# Altium project SwimmingPool.PrjPcb
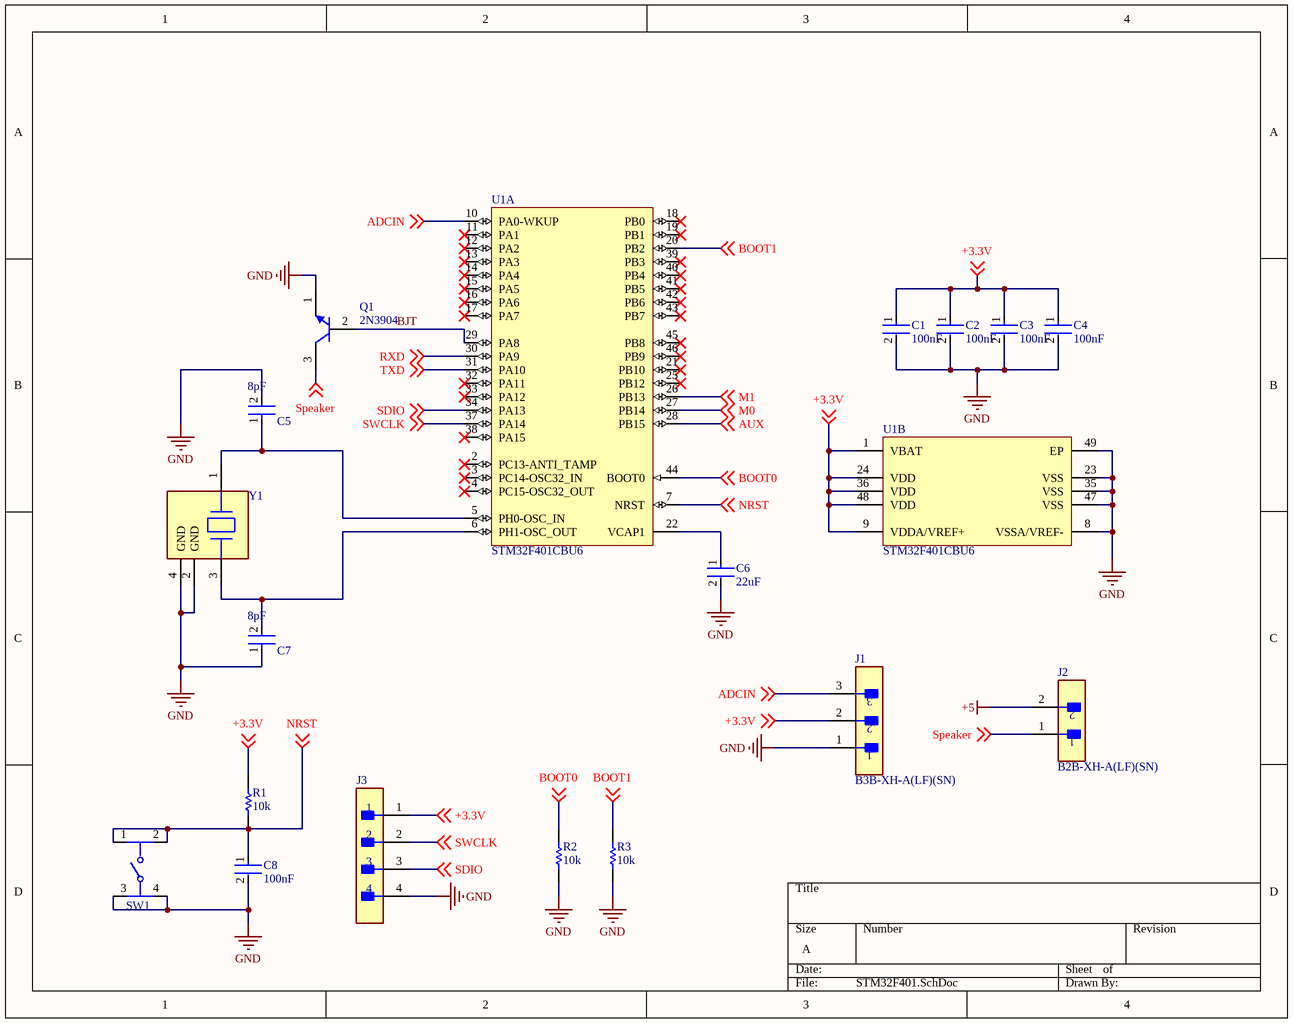
[diagram p0: STM32F401.SchDoc]
3 sheets, 44 parts. Net scope: global (net labels, ports and power ports of the same name join across sheets).
Board file: SwimmingPool.PcbDoc
Sheets:
  STM32F401.SchDoc
  TPS54336ADDA.SchDoc
  E49400T20S.SchDoc

## Sheet STM32F401.SchDoc
size A; SheetNumber: 1; SheetTotal: 3

### Parts
C1  100nF  [FP-CGA3E-0_3-0_1-IPC_A]
C2  100nF  [FP-CGA3E-0_3-0_1-IPC_A]
C3  100nF  [FP-CGA3E-0_3-0_1-IPC_A]
C4  100nF  [FP-CGA3E-0_3-0_1-IPC_A]
C5  8pF  [FP-CGA3E-0_3-0_1-IPC_A]
C6  22uF  [FP-GRM188-0_2-MFG]
C7  8pF  [FP-CGA3E-0_3-0_1-IPC_A]
C8  100nF  [FP-CGA3E-0_3-0_1-IPC_A]
J1  B3B-XH-A(LF)(SN)  [FP-B3B-XH-A_LF_SN-MFG]
J2  B2B-XH-A(LF)(SN)  [FP-B2B-XH-A_LF_SN-MFG]
J3  B04B-XASK-1(LF)(SN)  [FP-B04B-XASK-1_LF_SN-MFG]  (value not drawn)
Q1  2N3904  [ONSC-TO-92-3-29-11]
R1  10k  [RESC1609X55X30LL15T15]
R2  10k  [RESC1609X55X30LL15T15]
R3  10k  [RESC1609X55X30LL15T15]
SW1  PTS645SH50SMTR92LFS  [FP-PTS645SH50SMTR92LFS-MFG]  (value not drawn)
U1  STM32F401CBU6  [STM-UFQFPN48_M]  (parts A,B of 2)
Y1  CX2016DB40000D0FLJCC  [FP-CX2016DB-MFG]  (value not drawn)

### Nets
+5: J2.2  [project net 5V]
GND: C1.2 C2.2 C3.2 C4.2 C5.2 C6.2 C7.1 C8.2 J1.1 J3.4 Q1.1(E) R2.1 R3.1 SW1.3 SW1.4 U1.8(VSSA/VREF-) U1.23(VSS) U1.35(VSS) U1.47(VSS) U1.49(EP) Y1.2(GND) Y1.4(GND)
+3.3V: C1.1 C2.1 C3.1 C4.1 J1.2 J3.1 R1.2 U1.1(VBAT) U1.9(VDDA/VREF+) U1.24(VDD) U1.36(VDD) U1.48(VDD) ; off-sheet +3.3V  [project net 3V]
ADCIN: J1.3 U1.10(PA0-WKUP) ; off-sheet ADCIN
AUX: U1.28(PB15) ; off-sheet AUX
BJT: Q1.2(B) U1.29(PA8)
BOOT0: R2.2 U1.44(BOOT0) ; off-sheet BOOT0
BOOT1: R3.2 U1.20(PB2) ; off-sheet BOOT1
M0: U1.27(PB14) ; off-sheet M0
M1: U1.26(PB13) ; off-sheet M1
NRST: C8.1 R1.1 SW1.1 SW1.2 U1.7(NRST) ; off-sheet NRST
RXD: U1.30(PA9) ; off-sheet RXD
SDIO: J3.3 U1.34(PA13) ; off-sheet SDIO
Speaker: J2.1 Q1.3(C) ; off-sheet Speaker
SWCLK: J3.2 U1.37(PA14) ; off-sheet SWCLK
TXD: U1.31(PA10) ; off-sheet TXD
NetC5_1: C5.1 U1.5(PH0-OSC_IN) Y1.1
NetC6_1: C6.1 U1.22(VCAP1)
NetC7_2: C7.2 U1.6(PH1-OSC_OUT) Y1.3

Not connected (* = marked no-connect by the designer): U1 2(PC13-ANTI_TAMP)* 3(PC14-OSC32_IN)* 4(PC15-OSC32_OUT)* 11(PA1)* 12(PA2)* 13(PA3)* 14(PA4)* 15(PA5)* 16(PA6)* 17(PA7)* 18(PB0)* 19(PB1)* 21(PB10)* 25(PB12)* 32(PA11)* 33(PA12)* 38(PA15)* 39(PB3)* 40(PB4)* 41(PB5)* 42(PB6)* 43(PB7)* 45(PB8)* 46(PB9)*

### Library data of the parts
C1-C4 C8 = CMP-2000-07546-2: Cap Ceramic 100nF 50V X7R 10% Pad SMD 0603 +125°C Automotive T/R; Weight: 7.1E-05oz; Composition: Ceramic; Max Operating Temperature: 125°C; Termination: SMD/SMT; Dielectric: X7R; Length: 1.6mm; Package Quantity: 1; REACH SVHC: No SVHC; Lead Free: Lead Free; Case Code (Metric): 1608; Min Operating Temperature: -55°C; Packaging: Tape and Reel; Tolerance: 10%; Voltage Rating: 50V; Case Code (Imperial): 0603; Capacitance: 100nF; Case/Package: 0603; Voltage Rating (DC): 50V; Depth: 0.8mm; Radiation Hardening: No; Ratings: AEC-Q200; Mount: Surface Mount; Voltage: 50V; Thickness: 0.035inch; Width: 0.8mm; Height: 0.8mm
C5 C7 = CMP-08246-000516-1: Cap Ceramic 8pF 50V C0G 0.5pF Pad SMD 0603 +125°C Automotive T/R; Length: 1.6mm; Max Operating Temperature: 125°C; Voltage Rating: 50V; Depth: 0.8mm; Height: 0.8mm; Composition: Ceramic; Package Quantity: 4000; Thickness: 0.035inch; Packaging: Tape and Reel; Weight: 7.1E-05oz; Mount: Surface Mount; Ratings: AEC-Q200; Width: 0.031inch; Voltage Rating (DC): 50V; Termination: SMD/SMT; Case Code (Metric): 1608; Case Code (Imperial): 0603; Capacitance: 8pF; Min Operating Temperature: -55°C; Dielectric: C0G; Case/Package: 0603; Radiation Hardening: No; REACH SVHC: No SVHC
C6 = CMP-2000-06337-3: Chip Multilayer Ceramic Capacitors for General Purpose, 0603, 22uF, X5R, 15%, 20%, 10V; Tolerance: 20%; Weight: 0.000222oz; Material: Ceramic; Depth: 0.8mm; Length: 1.6mm; Termination: SMD/SMT; Capacitance: 22uF; Packaging: Tape and Reel; Width: 0.8mm; Voltage Rating: 10V; Case Code (Imperial): 0603; Mount: Surface Mount; Voltage Rating (DC): 10V; Case/Package: 0603; Thickness: 0.039inch; REACH SVHC: No SVHC; Dielectric: X5R; Height: 0.8mm; Package Quantity: 4000; Case Code (Metric): 1608; Min Operating Temperature: -55°C; Lead Free: Lead Free; Max Operating Temperature: 85°C
J1 = CMP-17439-000014-3: CONN HEADER VERT 3POS 2.5MM; Max Voltage Rating (DC): 250V; Number of Positions: 3; Current Rating: 3A; Gender: Male; Wire/Cable Gauge: 22AWG; Contact Resistance: 20mR; Insulation Resistance: 1GR; Insulation Material: Nylon; Contact Plating: Tin; Depth: 5.75mm; Contact Type: Male Pin; Max Operating Temperature: 85°C; Insulation Color: Natural; Voltage Rating (AC): 250V; Color: Natural; Connector Type: Header; Orientation: Straight; Fastening Type: Detent; Housing Color: White; Min Operating Temperature: -25°C; Termination: Solder; Voltage Rating: 250V; Series: XH; Pitch: 2.5mm; Contact Shape: Square; Number of Rows: 1; Lead Free: Lead Free; Packaging: Bulk; Mount: Through Hole; Flammability Rating: UL94 V-0; Max Voltage Rating (AC): 250V; REACH SVHC: No SVHC; Housing Material: Polyamide; Contact Material: Brass; Lead Pitch: 2.5mm; Contact Finish - Mating: TIN; Length: 9.9mm; Max Current Rating: 3A; Number of Contacts: 3
J2 = CMP-2000-05888-3: CONN HEADER VERT 2POS 2.5MM; Current Rating: 3A; Voltage Rating: 250V; Number of Contacts: 2; Contact Resistance: 20mR; Wire/Cable Gauge: 22AWG; Insulation Resistance: 1GR; Connector Type: Male Pin; Packaging: Bulk; Contact Material: Brass; Lead Free: Lead Free; Orientation: Straight; Contact Plating: Tin; Max Current Rating: 3A; Termination: Solder; Fastening Type: Detent; Depth: 5.75mm; Housing Material: Polyamide; REACH SVHC: No SVHC; Series: XH; Voltage Rating (AC): 250V; Number of Positions: 2; Color: Natural; Contact Type: Male Pin; Max Voltage Rating (DC): 250V; Pitch: 2.5mm; Lead Pitch: 2.5mm; Mount: Through Hole; Max Operating Temperature: 85°C; Length: 7.4mm; Max Voltage Rating (AC): 250V; Min Operating Temperature: -25°C; Number of Rows: 1; Housing Color: White
J3 = CMP-17439-000018-1: CONN HEADER VERT 4POS 2.5MM; Manufacturer: JST; Current Rating: 3A; Voltage Rating: 250V; Conn Orientation: Straight; Conn Gender: Male; Number Of Contacts: 4; ComponentLink2Description: Datasheet; Package: B04B-XASK-1(LF)(SN); Octopart: https://octopart.com/b04b-xask-1%28lf%29%28sn%29-jst-3990149; Pitch: 2.5mm; Device Class L1: Connectors; RoHS: TRUE; Device Class L3: unset; Manufacturer Part Number: B04B-XASK-1(LF)(SN); Temperature Range High: +85°C; Height: 8.8mm; Lead Free: Yes; Category: Conn; Temperature: -25°C to +85°C; Digikey Description: CONN HEADER VERT 4POS 2.5MM; Temperature Range Low: -25°C; ComponentLink2URL: http://www.jst-mfg.com/product/pdf/eng/eXA1.pdf; Contact Material: Tin,Copper; Device Class L2: Headers and Wire Housings; Automotive: No; Number Of Rows: 1
Q1 = CMP-2000-05562-1: General Purpose Transistor, NPN Silicon, 200 mA, 60 V, -55 to 150 degC, 3-Pin TO-92, RoHS, Bulk; Manufacturer: ONSemiconductor; Emitter- Base Voltage VEBO: 6V; Maximum Power Dissipation: 625mW; Maximum DC Collector Current: 0.2A; Collector- Emitter Voltage VCEO Max: 40V; Collector- Base Voltage VCBO: 60V; DC Collector/Base Gain hfe Min: 60; Configuration: Single; Collector-Emitter Saturation Voltage: 0.3V; Gain Bandwidth Product fT: 270MHz; Mounting Style: ThroughHole; Package / Case: TO-92-3(TO-226); Mounting Technology: ThroughHole; Minimum Operating Temperature: -65C; Datasheet Version: Rev. 8, 08/2012; Product Category: BipolarTransistors-BJT; Factory Pack Quantity: 5000; Transistor Polarity: NPN; Package Description: 3-Pin Transistor Outline, Body 4.825 x 3.685 mm, Pitch 1.27 mm; RoHS: Details; Datasheet URL: https://datasheet.ciiva.com/4725/2n3903-d-285841-4725808.pdf; Packaging: Bulk; Maximum Operating Temperature: +150C; Package Reference: TO-92-3-29-11; Brand: ONSemiconductor; Manufacturer URL: http://www.onsemi.com/
R1-R3 = CMP-1012-00623-3: Chip Resistor, 10 KOhm, +/- 1%, 0.1 W, -55 to 155 degC, 0603 (1608 Metric), RoHS, Tape and Reel; Manufacturer: Panasonic; Voltage Rating: 75V; Case\/Package: 0603; Power Rating: 100mW; Resistance: 10KOhm; Temperature Coefficient: 100ppm\/degreesC; Number of Pins: 2; Package Reference: 603; Depth: 0.8mm; Mount: SurfaceMount; Package Description: 2-Pin Surface Mount Device, Body 1.6 x 0.85 mm; Datasheet Version: 02/2017; Length: 1.6mm; Lead Free: LeadFree; Height: 0.45mm; Number of Terminations: 2; Max Power Dissipation: 100mW; Min Operating Temperature: -55degC; Datasheet URL: https://industrial.panasonic.com/cdbs/www-data/pdf/RDA0000/AOA0000C304.pdf; Termination: SMD/SMT; Case Code (Metric): 1608; Case Code (Imperial): 0603; Tolerance: 1%; Max Operating Temperature: 155degC; RoHSCompliant: true; Voltage Rating (DC): 75V; Radiation Hardening: No; Packaging: TapeandReel; Composition: ThickFilm; Mounting Technology: SurfaceMount; Manufacturer URL: http://www.panasonic.com/; Width: 0.031inch; REACH SVHC: NoSVHC; Contact Plating: Tin; Military Standard: Not; Package Quantity: 1
SW1 = CMP-10040-000028-1: SWITCH TACTILE SPST-NO 0.05A 12V; Operating Force: 200gf; Current Rating: 50mA; Illumination Type: Non-Illuminated; Actuator Material: Nylon; Throw Configuration: SPST; Switch Function: Off-Mom; Mechanical Life: 100000Cycles; Actuator Type: Standard; Packaging: Tape and Reel; Termination: Gull Wing; Max Operating Temperature: 60°C; Length: 6mm; REACH SVHC: No SVHC; Orientation: Straight; Max Voltage Rating (DC): 12V; Package Quantity: 1000; Max Current Rating: 50mA; Mount: Surface Mount; Contact Material: Bronze; Case/Package: SMD/SMT; Lead Free: Lead Free; Min Operating Temperature: -20°C; Contact Plating: Silver; Color: Black; Depth: 9mm; Voltage Rating (DC): 12V
U1 = CMP-0243-00118-2: ARM Cortex-M4 32-bit MCU+FPU, 105 DMIPS, 128 kB Flash, 64 kB Internal RAM, 36 I/Os, 48-pin UFQFPN, -40 to 85 degC, Tray; Manufacturer: STMicroelectronics; Internal RAM Size (kB): 64; I/Os (High Current): 36; Operating Frequency(F) (Processor speed) (MHz): 84; Supply Voltage(Vcc) min (V): 1.8; FLASH Size (Prog) (kB): 128; Supply Voltage(Vcc) max (V): 3.6; PackageDescription: 48-Pin Ultra Thin Fine Pitch Quad Flat No-Lead, 7 x 7 x 0.6 mm Body, 0.5 mm Pitch, Exposed Pad; Mounting Technology: Surface Mount; PartNumber: STM32F401CBU6; ComponentLink1Description: Manufacturer URL; ComponentLink1URL: http://www.st.com/web/en/home.html; Core: ARM Cortex-M4; ComponentLink2URL: http://www.st.com/st-web-ui/static/active/en/resource/technical/document/data_brief/DM00071938.pdf; ComponentLink3Description: Package Specification; DatasheetVersion: Rev. 1; PackageReference: UFQFPN48; Packing: Tray; PackageVersion: Rev. 1, 04/2013; ComponentLink3URL: http://www.st.com/st-web-ui/static/active/en/resource/technical/document/data_brief/DM00071938.pdf; ComponentLink2Description: Datasheet
Y1 = CMP-20727-000002-1: CRYSTAL 40.0000MHZ 8PF SMD; Manufacturer: Kyocera International Inc. Electronic Components; Esr: 50Ω; Tolerance: 15ppm; Frequency: 40MHz; Series: CX2016DB; RoHS: TRUE; Temperature Range High: +85°C; Height: 0.45mm; Manufacturer Part Number: CX2016DB40000D0FLJCC; ComponentLink2Description: Datasheet; Load Capacitance: 8pF; ComponentLink2URL: https://global.kyocera.com/prdct/electro/product/pdf/cx2016db_e.pdf; Temperature: -30°C to +85°C; Device Class L2: Crystals / Oscillators; Category: Crys; Mouser Description: Crystal 40MHz 8pF 4-Pin SMD T/R; Lead Free: Yes; Device Class L3: Crystals; Temperature Range Low: -30°C; Octopart: https://octopart.com/cx2016db40000d0fljcc-avx+%2F+kyocera-71139660; Device Class L1: Passive Components; Automotive: No; Digikey Description: CRYSTAL 40.0000MHZ 8PF SMD; Package: CX2016DB; Stability: 15ppm

## Sheet TPS54336ADDA.SchDoc
size A; SheetNumber: 2; SheetTotal: 3; SPICEModelCacheGCWZWCBQ: <root> / <DocumentId>GCWZWCBQ</DocumentId> / <CacheFrame Number="0"> / <Model Name="umk107bj105_a-t" Kind="CKT"> / <Text>* UMK107BJ105_A-T     SPICE MODEL  ( General Type ) / *-------------------------------------------------------------------------------------------------------- / * Model Generated by TAIYO YUDEN Corporation (http://www.ty-top.com) / * Version 1.0 / * TAIYO YUDEN Control No. 170508_130520 / * Copyright(c) 2012 TAIYO YUDEN CO.,LTD. All Rights Reserved. / *-------------------------------------------------------------------------------------------------------- / * / * Products Name : Multilayer Ceramic Capacitors / * / * Characteristics : / *     Capacitance : 1 uF , Rated Voltage : 50V , TCC : X5R / *     Case Size : 1.6 x 0.8 / 0.063 x 0.031 [mm/inch] , Thickness : 0.8 / 0.031 [mm/inch] / *     (Conditions: Temperature = 25 degC , DC Bias Current/Voltage = 0A / 0V) / * / * Frequency Range : 40Hz - 3GHz / * / * External Node Assignments : / * / *  1  o---| |---o  2 / * / *-------------------------------------------------------------------------------------------------------- / .SubCkt UMK107BJ105_A-T 1 2 / **************************** / C0 1 110 0.79929u / Cm 1 101 0.13681u / C1 101 102 0.26224u / Rc1 101 102 5.8806k / C2 102 103 0.057839u / Rc2 102 103 469.42 / C3 103 110 0.014568u / Rc3 103 110 14.853 / C2m 1 301 0.13283u / C21 301 302 1.2593u / Rc21 301 302 6.3079k / C22 302 303 1.1189u / Rc22 302 303 6.9405k / C23 303 304 1.1421u / Rc23 303 304 6.4848k / C24 304 305 0.36861u / Rc24 304 305 785 / C25 305 306 0.39327u / Rc25 305 306 637.41 / C26 306 307 0.27451u / Rc26 306 307 19.365 / C27 307 308 0.15295u / Rc27 307 308 23.239 / C28 308 309 0.17569u / Rc28 308 309 17.788 / C29 309 110 1420.6p / Rc29 309 110 1.9725 / Rp0 1 110 500Meg / L0 110 120 0.24088n / Lm 120 130 0.1369n / L1 120 121 0.1842n / RL1 121 130 0.29804 / L2 120 122 0.40657n / RL2 122 130 0.57395 / L3 120 123 0.85773n / RL3 123 130 0.82282 / CR 120 124 0.11463u / LR 124 125 0.25983n / RR 125 130 52.447m / CL 130 140 1.4637p / LL 130 140 0.23986n / RL 130 140 33.985 / Rs 140 2 6.8539m / **************************** / .ends UMK107BJ105_A-T</Text> / </Model> / </CacheFrame> / </root>
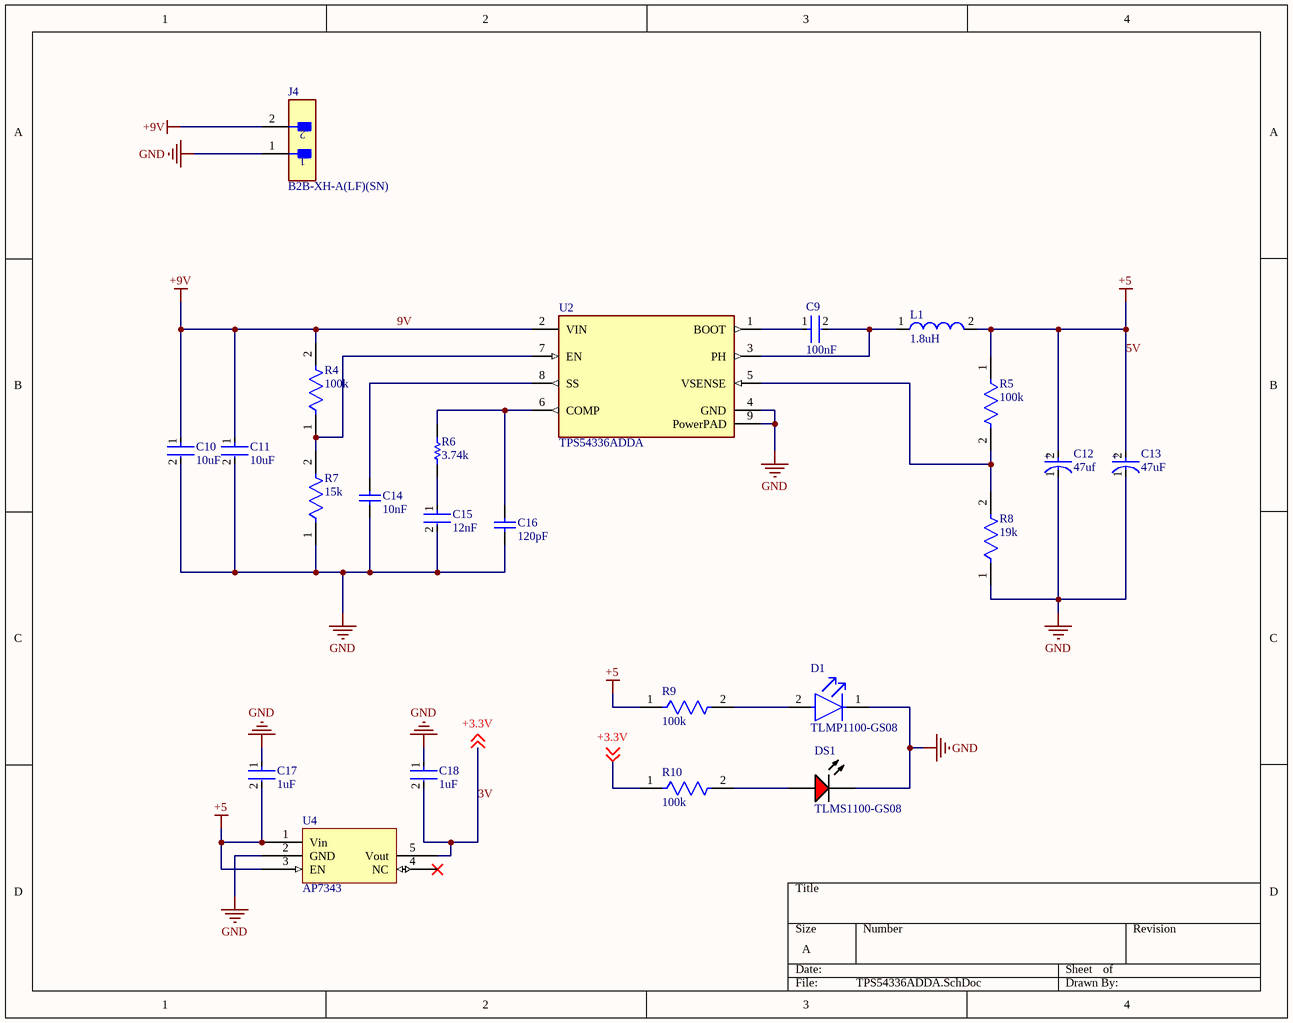
[diagram p1: TPS54336ADDA.SchDoc]

### Parts
C9  100nF  [FP-CGA3E-0_3-0_1-IPC_A]
C10  10uF  [FP-GRM188-0_2-MFG]
C11  10uF  [FP-GRM188-0_2-MFG]
C12  47uf  [FP-T491D476K025AT-MFG]
C13  47uF  [FP-T491D476K025AT-MFG]
C14  10nF  [CAPC1608X90X35ML10T15]
C15  12nF  [FP-C0603C-CF-MFG]
C16  120pF  [CAPC1608X87X35NL15T15]
C17  1uF  [FP-0603-L_1_6_0_1-W_0_8_0-IPC_B]
C18  1uF  [FP-0603-L_1_6_0_1-W_0_8_0-IPC_B]
D1  TLMP1100-GS08  [FP-6_541-5056_01-4-MFG]
DS1  TLMS1100-GS08  [VISH-TLMX1100_V]
J4  B2B-XH-A(LF)(SN)  [FP-B2B-XH-A_LF_SN-MFG]
L1  1.8uH  [WE-PDF-1045]
R4  100k  [FP-RC0603-0_55-MFG]
R5  100k  [FP-ERA3A-IPC_A]
R6  3.74k  [RESC1608X55X30ML15T15]
R7  15k  [FP-CRCW0603-e3-MFG]
R8  19k  [FP-CRCW0603-e3-IPC_A]
R9  100k  [FP-ERA3A-IPC_A]
R10  100k  [FP-ERA3A-IPC_A]
U2  TPS54336ADDA  [FP-DDA0008E-IPC_C]
U4  AP7343  [SOT95P245X110-5N]

### Nets
5V: C12.2(A) C13.2(A) C17.2 L1.2 R5.1 R9.1 U4.1(Vin) U4.3(EN)  [also labelled +5]
9V: C10.1 C11.1 J4.2 R4.2 U2.2(VIN)  [also labelled +9V]
GND: C10.2 C11.2 C12.1(C) C13.1(C) C14.1 C15.2 C16.1 C17.1 C18.1 D1.1(C) DS1.2(K) J4.1 R7.1 R8.1 U2.4(GND) U2.9(PowerPAD) U4.2(GND)
3V: C18.2 R10.1 U4.5(Vout) ; off-sheet +3.3V  [also labelled +3.3V]
NetC9_1: C9.1 U2.1(BOOT)
NetC9_2: C9.2 L1.1 U2.3(PH)
NetC14_2: C14.2 U2.8(SS)
NetC15_1: C15.1 R6.1
NetC16_2: C16.2 R6.2 U2.6(COMP)
NetD1_2: D1.2(A) R9.2
NetDS1_1: DS1.1(A) R10.2
NetR4_1: R4.1 R7.2 U2.7(EN)
NetR5_2: R5.2 R8.2 U2.5(VSENSE)

Not connected (* = marked no-connect by the designer): U4 4(NC)*

### Notes on the sheet
- (in symbol CMP-03017-000020-1) +

### Library data of the parts
C9 = CMP-2000-07546-2: as C1 on sheet STM32F401; Weight: 7.1E-05oz; Composition: Ceramic; Max Operating Temperature: 125°C; Termination: SMD/SMT; Dielectric: X7R; Length: 1.6mm; Package Quantity: 1; REACH SVHC: No SVHC; Lead Free: Lead Free; Case Code (Metric): 1608; Min Operating Temperature: -55°C; Packaging: Tape and Reel; Tolerance: 10%; Voltage Rating: 50V; Case Code (Imperial): 0603; Capacitance: 100nF; Case/Package: 0603; Voltage Rating (DC): 50V; Depth: 0.8mm; Radiation Hardening: No; Ratings: AEC-Q200; Mount: Surface Mount; Voltage: 50V; Thickness: 0.035inch; Width: 0.8mm; Height: 0.8mm
C10 C11 = CMP-2006-02520-2: Chip Multilayer Ceramic Capacitors for General Purpose, 0603, 10uF, X5R, 15%, 20%, 25V; Tolerance: 20%; Resistor Type: Ceramic; Voltage: 25V; Max Operating Temperature: 85°C; Min Operating Temperature: -55°C; Capacitance: 10uF; Dielectric: X5R; Lead Free: Lead Free; REACH SVHC: No SVHC; Case/Package: 0603; Mount: Surface Mount; Voltage Rating (DC): 25V; Height: 0.8mm; Length: 1.6mm; Thickness: 0.031inch; Width: 0.031inch; Termination: SMD/SMT; Case Code (Imperial): 0603; Case Code (Metric): 1608; Package Quantity: 1; Packaging: Tape and Reel; Depth: 0.8mm; Voltage Rating: 25V; Weight: 0.000222oz; Number of Pins: 2
C12 C13 = CMP-03017-000020-1: CAP TANT 47UF 10% 25V 2917; Dielectric Material: Tantalum; Life (Hours): 2000Hour; Ripple Current: 463mA; Leakage Current: 11.8uA; Polarity: Polar; ESR (Equivalent Series Resistance): 700mR; Height - Seated (Max): 0.122inch; Package Quantity: 1; Max Operating Temperature: 125°C; Failure Rate: 0.001%; Height: 2.8mm; Voltage Rating (DC): 25V; Dissipation Factor: 10%; Mount: Surface Mount; Min Operating Temperature: -55°C; Packaging: Tape and Reel; Radiation Hardening: No; Case Code (Metric): 7343; Features: General Purpose; Voltage: 25V; Case/Package: 2917; Capacitance: 47uF; Case Code (Imperial): 2917; Tolerance: 10%; Number of Pins: 2; Weight: 0.023634oz; REACH SVHC: No SVHC; RoHS Compliant: Yes; Length: 7.3mm; Depth: 4.3mm; Lead Free: Lead Free; Width: 4.3mm; Voltage Rating: 25V; Termination: SMD/SMT
C14 = CMP-2100-03642-1: Chip Capacitor, 10 nF, +/- 10%, 50 V, -55 to 125 degC, 0603 (1608 Metric), RoHS, Tape and Reel; Manufacturer: Murata; Insulation Resistance: 10GR; Dielectric: X7R; Voltage Rating: 50V; Material: Ceramic; Package Quantity: 1; Lead Free: LeadFree; Case/Package: 0603; Termination: SMD/SMT; REACH SVHC: Unknown; Manufacturer URL: http://www.murata.com/; Datasheet URL: http://search.murata.co.jp/Ceramy/image/img/A01X/G101/ENG/GRM188R71H103KA01-01.pdf; Mount: SurfaceMount; Datasheet Version: 42401.0; Number of Pins: 2; Length: 1.6mm; Voltage: 50V; Depth: 0.8mm; Tolerance: 10%; Min Operating Temperature: -55degC; Voltage Rating (DC): 50V; Max Operating Temperature: 125degC; Package Description: 2-Pin Surface Mount Device, Body 1.6 x 0.8 mm; RoHSCompliant: True; Case Code (Imperial): 0603; Width: 0.031inch; Case Code (Metric): 1608; Height: 0.8mm; Package Reference: 0603; Packaging: TapeandReel; Thickness: 0.035inch; Capacitance: 10nF; Dielectric Material: Ceramic
C15 = CMP-2006-02245-2: CAP CER 0.012UF 50V 10% X7R 0603; Manufacturer: KEMET; Manufacturer Part Number: C0603C123K5RACTU; Value: 12,000 pF; Automotive Grade: Grade 1; Material: Ceramic; Tolerance: 0.1; Temperature Coefficient: 30ppm/°C; Category: Cap; Height: 0.87mm; Lead Free: Yes; Temperature: -55°C to +125°C; Device Class L2: Capacitors; RoHS: TRUE; Capacitance: 12,000 pF; Mouser Description: Multilayer Ceramic Capacitors MLCC - SMD/SMT 50volts 12000pF X7R 10%; Temperature Range Low: -55°C; Temperature Range High: +125°C; Temperature Characteristic: X7R; Device Class L1: Passive Components; Package: C0603C-CF; Voltage Rating: 50 V; Octopart: https://octopart.com/c0603c123k5ractu-kemet-9143719; Device Class L3: Ceramic Capacitors; ComponentLink2URL: https://api.kemet.com/component-edge/download/datasheet/C0603C100J5GACAUTO.pdf; Automotive: Yes; ComponentLink2Description: Datasheet; Digikey Description: CAP CER 0.012UF 50V 10% X7R 0603
C16 = CMP-2006-03074-1: Manufacturer: Kemet; Part Number: C0603C121J5GACTU
C17 C18 = CMP-2000-05447-3: None; Tolerance: 10%; Voltage Rating: 50V; Dielectric: X5R; Height: 0.8mm; Depth: 0.8mm; Number of Pins: 2; Length: 1.6mm; Thickness: 0.035inch; Contact Plating: Nickel; Radiation Hardening: No; Package Quantity: 1; Case/Package: 0603; Capacitance: 1uF; Halogen Free: Halogen Free; RoHS Compliant: Yes; Termination: SMD/SMT; Max Operating Temperature: 85°C; Min Operating Temperature: -55°C; Case Code (Metric): 1608; Construction: Flat; Voltage Rating (DC): 50V; Packaging: Tape and Reel; Series: M; Case Code (Imperial): 0603; Width: 0.031inch; Mount: Surface Mount
D1 = CMP-02520-000009-1: LED GREEN 0603 SMD; Manufacturer: Vishay; Max Junction Temp: +120°C; Automotive Grade: Grade 3; Reverse Voltage: 6V; Led Orientation: Top View; Forward Voltage: 2.1V; Luminous Intensity: 15mcd; Forward Current: 20mA; Colour: Pure green; Peak Emmision Wavelength: 562nm; Wavelength: 561nm; Viewing Angle: 160°; Power Dissipation: 90mW; Digikey Description: LED GREEN 0603 SMD; Package: 6.541-5056.01-4; Ambient Temperature Range High: +100°C; Height: 0.65mm; Device Class L1: Optoelectronics; Device Class L2: LEDs; Mouser Description: Standard LEDs - SMD Pure Green; Temperature Range High: +120°C; RoHS: TRUE; Ambient Temperature Range Low: -40°C; Temperature: to +120°C; Manufacturer Part Number: TLMP1100-GS08; ComponentLink2URL: http://www.vishay.com/docs/83173/tlmb1100.pdf; Lead Free: Yes; Octopart: https://octopart.com/tlmp1100-gs08-vishay-55433993; Automotive: Yes; Device Class L3: unset; ComponentLink2Description: Datasheet; Category: Diode
DS1 = CMP-1666-00027-1: LED, RED, 2.1 V, -40 to 100 degC, 2-Pin SMD (0603), RoHS, Tape and Reel; Type (Capacitors): C0G; Resistance: 100000000000 Ohm; Capacitance: 12 pF; Voltage Rating: 50 V; Tolerance: 5%; Min Operating Temperature: -55degC; REACH SVHC: No SVHC; ComponentLink2Description: Datasheet; ComponentLink1URL: http://www.vishay.com/; Width: 0.8 mm; Package Quantity: 4000; PackageReference: TLMX1100; ComponentLink2URL: http://www.vishay.com/docs/83173/tlmb1100.pdf; Case/Package: 0603; Case Code (Metric): 1608; Packaging: Tape and Reel; Pins: 2; ComponentLink1Description: Manufacturer URL; Max Operating Temperature: 125degC; Height: 0.8 mm; Length: 1.6 mm; Mount: Surface Mount; PackageDescription: 2-Pin Surface Mount Device, Body 1.6 x 0.8 mm; DatasheetVersion: Rev. 2.7, 03/2016; Case Code (Imperial): 0603; Voltage Rating (DC): 50 V; RoHSCompliant: True; Radiation Hardening: No
J4 = CMP-2000-05888-3: as J2 on sheet STM32F401; Packaging: Bulk; Contact Material: Brass; Lead Free: Lead Free; Orientation: Straight; Contact Plating: Tin; Max Current Rating: 3A; Termination: Solder; Fastening Type: Detent; Depth: 5.75mm; Housing Material: Polyamide; REACH SVHC: No SVHC; Series: XH; Voltage Rating (AC): 250V; Number of Positions: 2; Color: Natural; Contact Type: Male Pin; Max Voltage Rating (DC): 250V; Pitch: 2.5mm; Lead Pitch: 2.5mm; Mount: Through Hole; Max Operating Temperature: 85°C; Length: 7.4mm; Max Voltage Rating (AC): 250V; Min Operating Temperature: -25°C; Number of Rows: 1; Housing Color: White
L1 = CMP-0227-00049-1: SMD Power Inductor WE-PDF, L = 1.80 µH; Inductance: 1.80 ÂµH; ComponentLink2Description: Datasheet; ComponentLink1URL: http://www.we-online.com; ComponentLink1Description: Manufacturer Link; ComponentLink2URL: http://www.we-online.de/katalog/media/pdf/7447797180.pdf; PackageVersion: 2009; PackageReference: WE-PDF-1045; PackageDescription: SMD Inductor, 2-Leads, Body 10.2 x 10.2 mm; DatasheetVersion: ver 2, Jul-2009
R4 = CMP-2100-03662-2: RES SMD 100K OHM 1% 1/10W 0603; Voltage Rating (DC): 50V; Resistance: 100kR; Max Power Dissipation: 100mW; Temperature Coefficient: 100ppm/°C; Working Voltage: 75V; Length: 1.6mm; Lead Free: Lead Free; Number of Terminations: 2; Packaging: Tape and Reel; Voltage Rating: 50V; Termination: SMD/SMT; Width: 0.8mm; Resistor Type: Thick Film; Resistance Tolerance: 1%; Features: Moisture Resistant; Height: 0.45mm; Construction: Rectangular; Case/Package: 0603; Military Standard: Not; Case Code (Imperial): 0603; Series: RC; Technology: THICK FILM; Depth: 0.8mm; RoHS Compliant: Yes; REACH SVHC: No SVHC; Min Operating Temperature: -55°C; Case Code (Metric): 1608; Max Operating Temperature: 155°C; Power Rating: 100mW; Number of Pins: 2; Tolerance: 1%
R5 R9 R10 = CMP-2000-00873-2: RES SMD 100K OHM 0.1% 1/10W 0603; Temperature Coefficient: 25ppm/°C; Voltage Rating: 75V; Max Power Dissipation: 100mW; Resistance: 1kR; Technology: METAL FILM; Number of Pins: 2; Packaging: Tape and Reel; Case Code (Imperial): 0603; Case Code (Metric): 1608; Min Operating Temperature: -55°C; REACH SVHC: No SVHC; Length: 1.6mm; Termination: SMD/SMT; Depth: 0.8mm; Resistance Tolerance: 0.1%; Number of Terminations: 2; Width: 0.8mm; Military Standard: Not; Tolerance: 0.1%; Package Quantity: 5000; Contact Plating: Tin; Height: 0.45mm; Construction: Rectangular; Case/Package: 0603; Max Operating Temperature: 155°C; Resistor Type: Thin Film; Series: ERA-3A; Size Code: 0603; RoHS Compliant: Yes; Mount: Surface Mount; Radiation Hardening: No; Power Rating: 100mW
R6 = CMP-2000-00466-1: Part Number: ERJ-3EKF3741V; Manufacturer: Panasonic
R7 = CMP-2000-02920-2: RES Thick Film, 15kΩ, 1%, 0.1W, 100ppm/°C, 0603; Resistance: 15kR; Voltage Rating: 75V; Power Rating: 100mW; Temperature Coefficient: 100ppm/°C; Mount: Surface Mount; Depth: 0.85mm; Min Operating Temperature: -55°C; Max Operating Temperature: 155°C; Contact Plating: Tin; Composition: Thick Film; Lead Free: Lead Free; Voltage Rating (DC): 75V; Termination: SMD/SMT; Packaging: Tape and Reel; Length: 1.55mm; Military Standard: Not; Weight: 7.1E-05oz; Width: 0.85mm; Package Quantity: 5000; Radiation Hardening: No; Height: 0.45mm; Case/Package: 0603; Case Code (Metric): 1608; Tolerance: 1%; Case Code (Imperial): 0603
R8 = CMP-2000-02958-2: RES Thick Film, 18kΩ, 1%, 0.1W, 100ppm/°C, 0603; Max Power Dissipation: 100mW; Working Voltage: 75V; Resistance: 18kR; Min Operating Temperature: -55°C; Package Quantity: 10; Height: 0.45mm; Width: 0.033inch; Depth: 0.85mm; Radiation Hardening: No; Lead Free: Lead Free; Number of Pins: 2; Composition: Thick Film; Case Code (Imperial): 0603; Temperature Coefficient: 100ppm/°C; Military Standard: Not; Features: Automotive AEC-Q200; Power Rating: 100mW; Number of Terminations: 2; Weight: 7.1E-05oz; Case/Package: 0603; Voltage Rating: 75V; Mount: Surface Mount; Termination: SMD/SMT; Voltage Rating (DC): 75V; Length: 1.55mm; Case Code (Metric): 1608; Tolerance: 1%; Packaging: Tape and Reel; Max Operating Temperature: 155°C; Contact Plating: Tin
U2 = CMP-04918-000301-1: IC REG BUCK ADJUSTABLE 3A 8SOPWR; Min Output Voltage: 800mV; Output Voltage: 25V; Min Input Voltage: 4.5V; Number of Outputs: 1; Max Input Voltage: 28V; Synchronous Rectifier: Yes; Quiescent Current: 600uA; Switching Frequency: 340kHz; Output Configuration: Positive; REACH SVHC: No SVHC; Number of Pins: 8; RoHS Compliant: Yes; Max Output Voltage: 25V; Lead Free: Lead Free; Output Type: Adjustable; Max Operating Temperature: 150°C; Mount: Surface Mount; Output Current: 3A; Min Operating Temperature: -40°C; Packaging: Cut Tape; Case/Package: SOIC
U4 = Component_2

## Sheet E49400T20S.SchDoc
size A; SheetNumber: 3; SheetTotal: 3
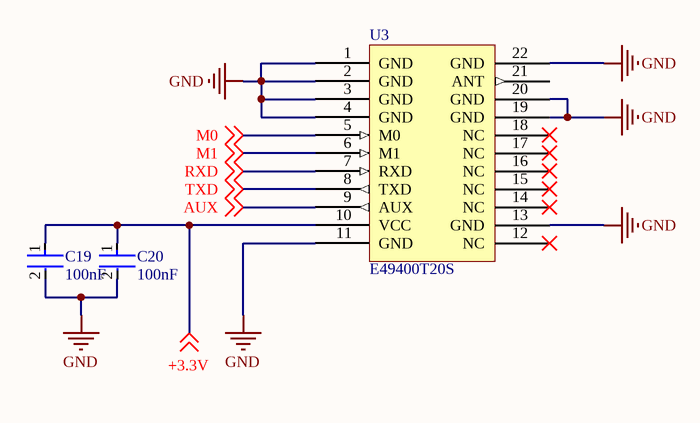
[diagram p2: E49400T20S.SchDoc]

### Parts
C19  100nF  [FP-CGA3E-0_3-0_1-IPC_A]
C20  100nF  [FP-CGA3E-0_3-0_1-IPC_A]
U3  E49400T20S  [PCBComponent_1]

### Nets
GND: C19.2 C20.2 U3.1(GND) U3.2(GND) U3.3(GND) U3.4(GND) U3.11(GND) U3.13(GND) U3.19(GND) U3.20(GND) U3.22(GND)
+3.3V: C19.1 C20.1 U3.10(VCC) ; off-sheet +3.3V  [project net 3V]
AUX: U3.9(AUX) ; off-sheet AUX
M0: U3.5(M0) ; off-sheet M0
M1: U3.6(M1) ; off-sheet M1
RXD: U3.7(RXD) ; off-sheet RXD
TXD: U3.8(TXD) ; off-sheet TXD

Not connected (* = marked no-connect by the designer): U3 12(NC)* 14(NC)* 15(NC)* 16(NC)* 17(NC)* 18(NC)* 21(ANT)

### Library data of the parts
C19 C20 = CMP-2000-07546-2: as C1 on sheet STM32F401; Weight: 7.1E-05oz; Composition: Ceramic; Max Operating Temperature: 125°C; Termination: SMD/SMT; Dielectric: X7R; Length: 1.6mm; Package Quantity: 1; REACH SVHC: No SVHC; Lead Free: Lead Free; Case Code (Metric): 1608; Min Operating Temperature: -55°C; Packaging: Tape and Reel; Tolerance: 10%; Voltage Rating: 50V; Case Code (Imperial): 0603; Capacitance: 100nF; Case/Package: 0603; Voltage Rating (DC): 50V; Depth: 0.8mm; Radiation Hardening: No; Ratings: AEC-Q200; Mount: Surface Mount; Voltage: 50V; Thickness: 0.035inch; Width: 0.8mm; Height: 0.8mm
U3 = Component_1

## Nets that join several sheets
5V: STM32F401 (J2.2), TPS54336ADDA (8 pins)
GND: STM32F401 (22 pins), TPS54336ADDA (17 pins), E49400T20S (11 pins)
3V: STM32F401 (12 pins), TPS54336ADDA (C18.2 R10.1 U4.5), E49400T20S (C19.1 C20.1 U3.10)
AUX: STM32F401 (U1.28), E49400T20S (U3.9)
M0: STM32F401 (U1.27), E49400T20S (U3.5)
M1: STM32F401 (U1.26), E49400T20S (U3.6)
RXD: STM32F401 (U1.30), E49400T20S (U3.7)
TXD: STM32F401 (U1.31), E49400T20S (U3.8)